# Altium project MiroCard.PrjPcb (part 1 of 2)
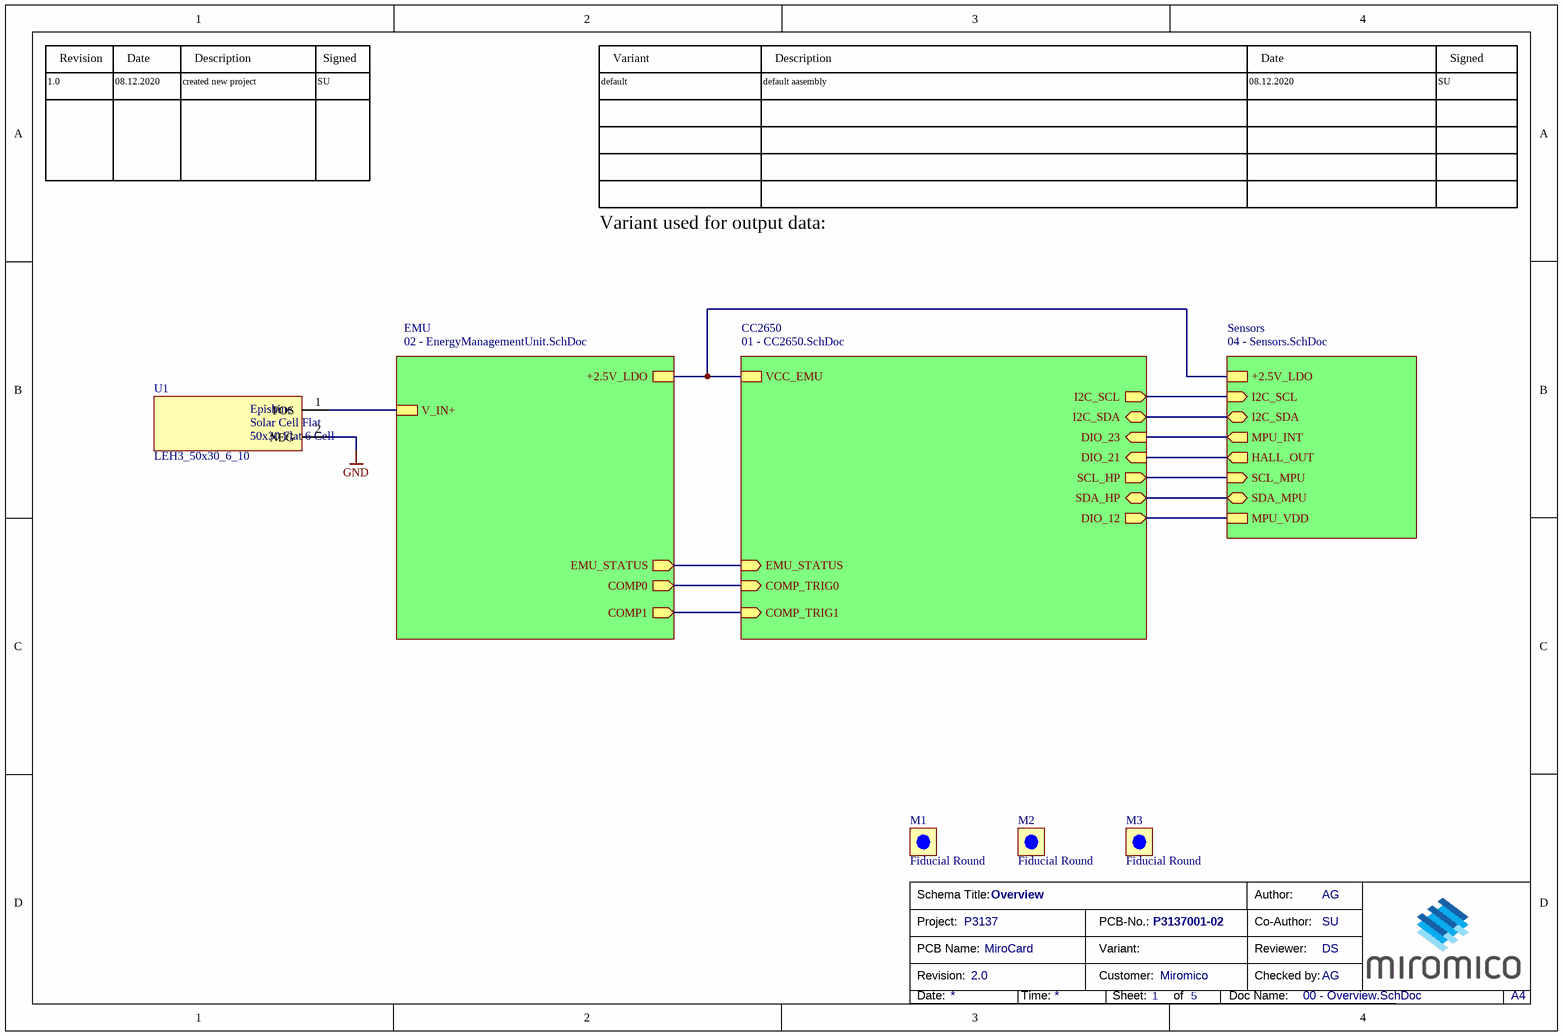
[diagram p0: 00 - Overview.SchDoc]
AuthorMiromico: AG; CheckedByMiromico: AG; CoAuthorMiromico: SU; Customer: Miromico; DrawnBy: AG; PCBName: MiroCard; PCBNumberMiromico: P3137001-02; ProjectName: MiroCard; ProjectNumberMiromico: P3137; ProjectRevision: 2.0; Reviewer: DS
5 sheets, 115 parts. Net scope: hierarchical (ports join the sheet entries above them; power ports are global).
Board files: MiroCard.PcbDoc, MiroCard_Panel.PcbDoc
Sheets:
  00 - Overview.SchDoc
    CC2650 = 01 - CC2650.SchDoc
    EMU = 02 - EnergyManagementUnit.SchDoc
      U_AEM10941 = 03 - AEM10941.SchDoc
    Sensors = 04 - Sensors.SchDoc

## Sheet 00 - Overview.SchDoc
size A4; Date: 13/4/18; Author: LS, OB, AG; DrawnBy: LS, OB, AB, AG, IM; Organization: Miromico, ETHZ; Revision: 3; SheetNumber: 1; SheetTotal: 5; SchemaTitle: Overview; ProjectName: Transient BLE System

### Parts
M1  Fiducial Round  [Fiducial round_small]  (no BOM)
M2  Fiducial Round  [Fiducial round_small]  (no BOM)
M3  Fiducial Round  [Fiducial round_small]  (no BOM)
U1  LEH3_50x30_6_10  [50x30 Flat 6 Cell - Gen 2-Footprint-1]

### Sub-sheets
CC2650 = 01 - CC2650.SchDoc: I2C_SCL (out), I2C_SDA (bidir), EMU_STATUS (in), COMP_TRIG0 (in), VCC_EMU, DIO_23 (in), DIO_21 (in), SCL_HP (out), SDA_HP (bidir), DIO_12 (out), COMP_TRIG1 (in)
EMU = 02 - EnergyManagementUnit.SchDoc: V_IN+, EMU_STATUS (out), COMP0 (out), +2.5V_LDO, COMP1 (out)
Sensors = 04 - Sensors.SchDoc: I2C_SCL (in), I2C_SDA (bidir), MPU_INT (out), +2.5V_LDO, HALL_OUT (out), SCL_MPU (in), SDA_MPU (bidir), MPU_VDD

### Nets
+2.5V_LDO: sheet CC2650/VCC_EMU, sheet EMU/+2.5V_LDO, sheet Sensors/+2.5V_LDO
GND: U1.2(NEG)
MPU_VDD: sheet CC2650/DIO_12, sheet Sensors/MPU_VDD
VSRC: U1.1(POS) ; sheet EMU/V_IN+
COMP0: sheet CC2650/COMP_TRIG0, sheet EMU/COMP0
COMP1: sheet CC2650/COMP_TRIG1, sheet EMU/COMP1
SCL: sheet CC2650/I2C_SCL, sheet Sensors/I2C_SCL
SDA: sheet CC2650/I2C_SDA, sheet Sensors/I2C_SDA
NetR402_2: sheet CC2650/SCL_HP, sheet Sensors/SCL_MPU
NetR403_2: sheet CC2650/SDA_HP, sheet Sensors/SDA_MPU
NetR404_2: sheet CC2650/DIO_23, sheet Sensors/MPU_INT
NetU100_31: sheet CC2650/DIO_21, sheet Sensors/HALL_OUT
NetU100_37: sheet CC2650/EMU_STATUS, sheet EMU/EMU_STATUS

### Notes on the sheet
- 1.0
- Revision
- 08.12.2020
- Date
- created new project
- Description
- SU
- Signed
- default
- Variant
- default aasembly
- Variant used for output data:
- Schema Title:
- Project:
- PCB-No.:
- Author:
- Co-Author:
- Revision:
- PCB Name:
- Customer:
- Variant:
- Reviewer:
- Checked by:
- Date:
- Time:
- Sheet:
- of
- Doc Name:
- A4
- (in symbol CMP-00499-06) Solar Cell Flat; 50x30 Flat 6 Cell

### Library data of the parts
M1-M3 = Fiducial Round-10: Fiducial (Optical Marker)
U1 = CMP-00499-06: Solar Cell 50x30 Flat 6 Cell; Manufacturer: Epishine; ComponentLink1Description: Datasheet; Manufacturer Part Number: LEH3_50x30_6_10; Supplier 1: Epishine; Supplier Part Number 1: LEH3_50x30_6_10

## Sheet 01 - CC2650.SchDoc: CC2650 MCU and BLE Radio
size A3; DrawnBy: LS, OB, AB, AG, IM; Organization: Miromico, ETHZ; Revision: 3; SheetNumber: 2; SheetTotal: 4; SchemaTitle: CC2650 MCU and BLE Radio
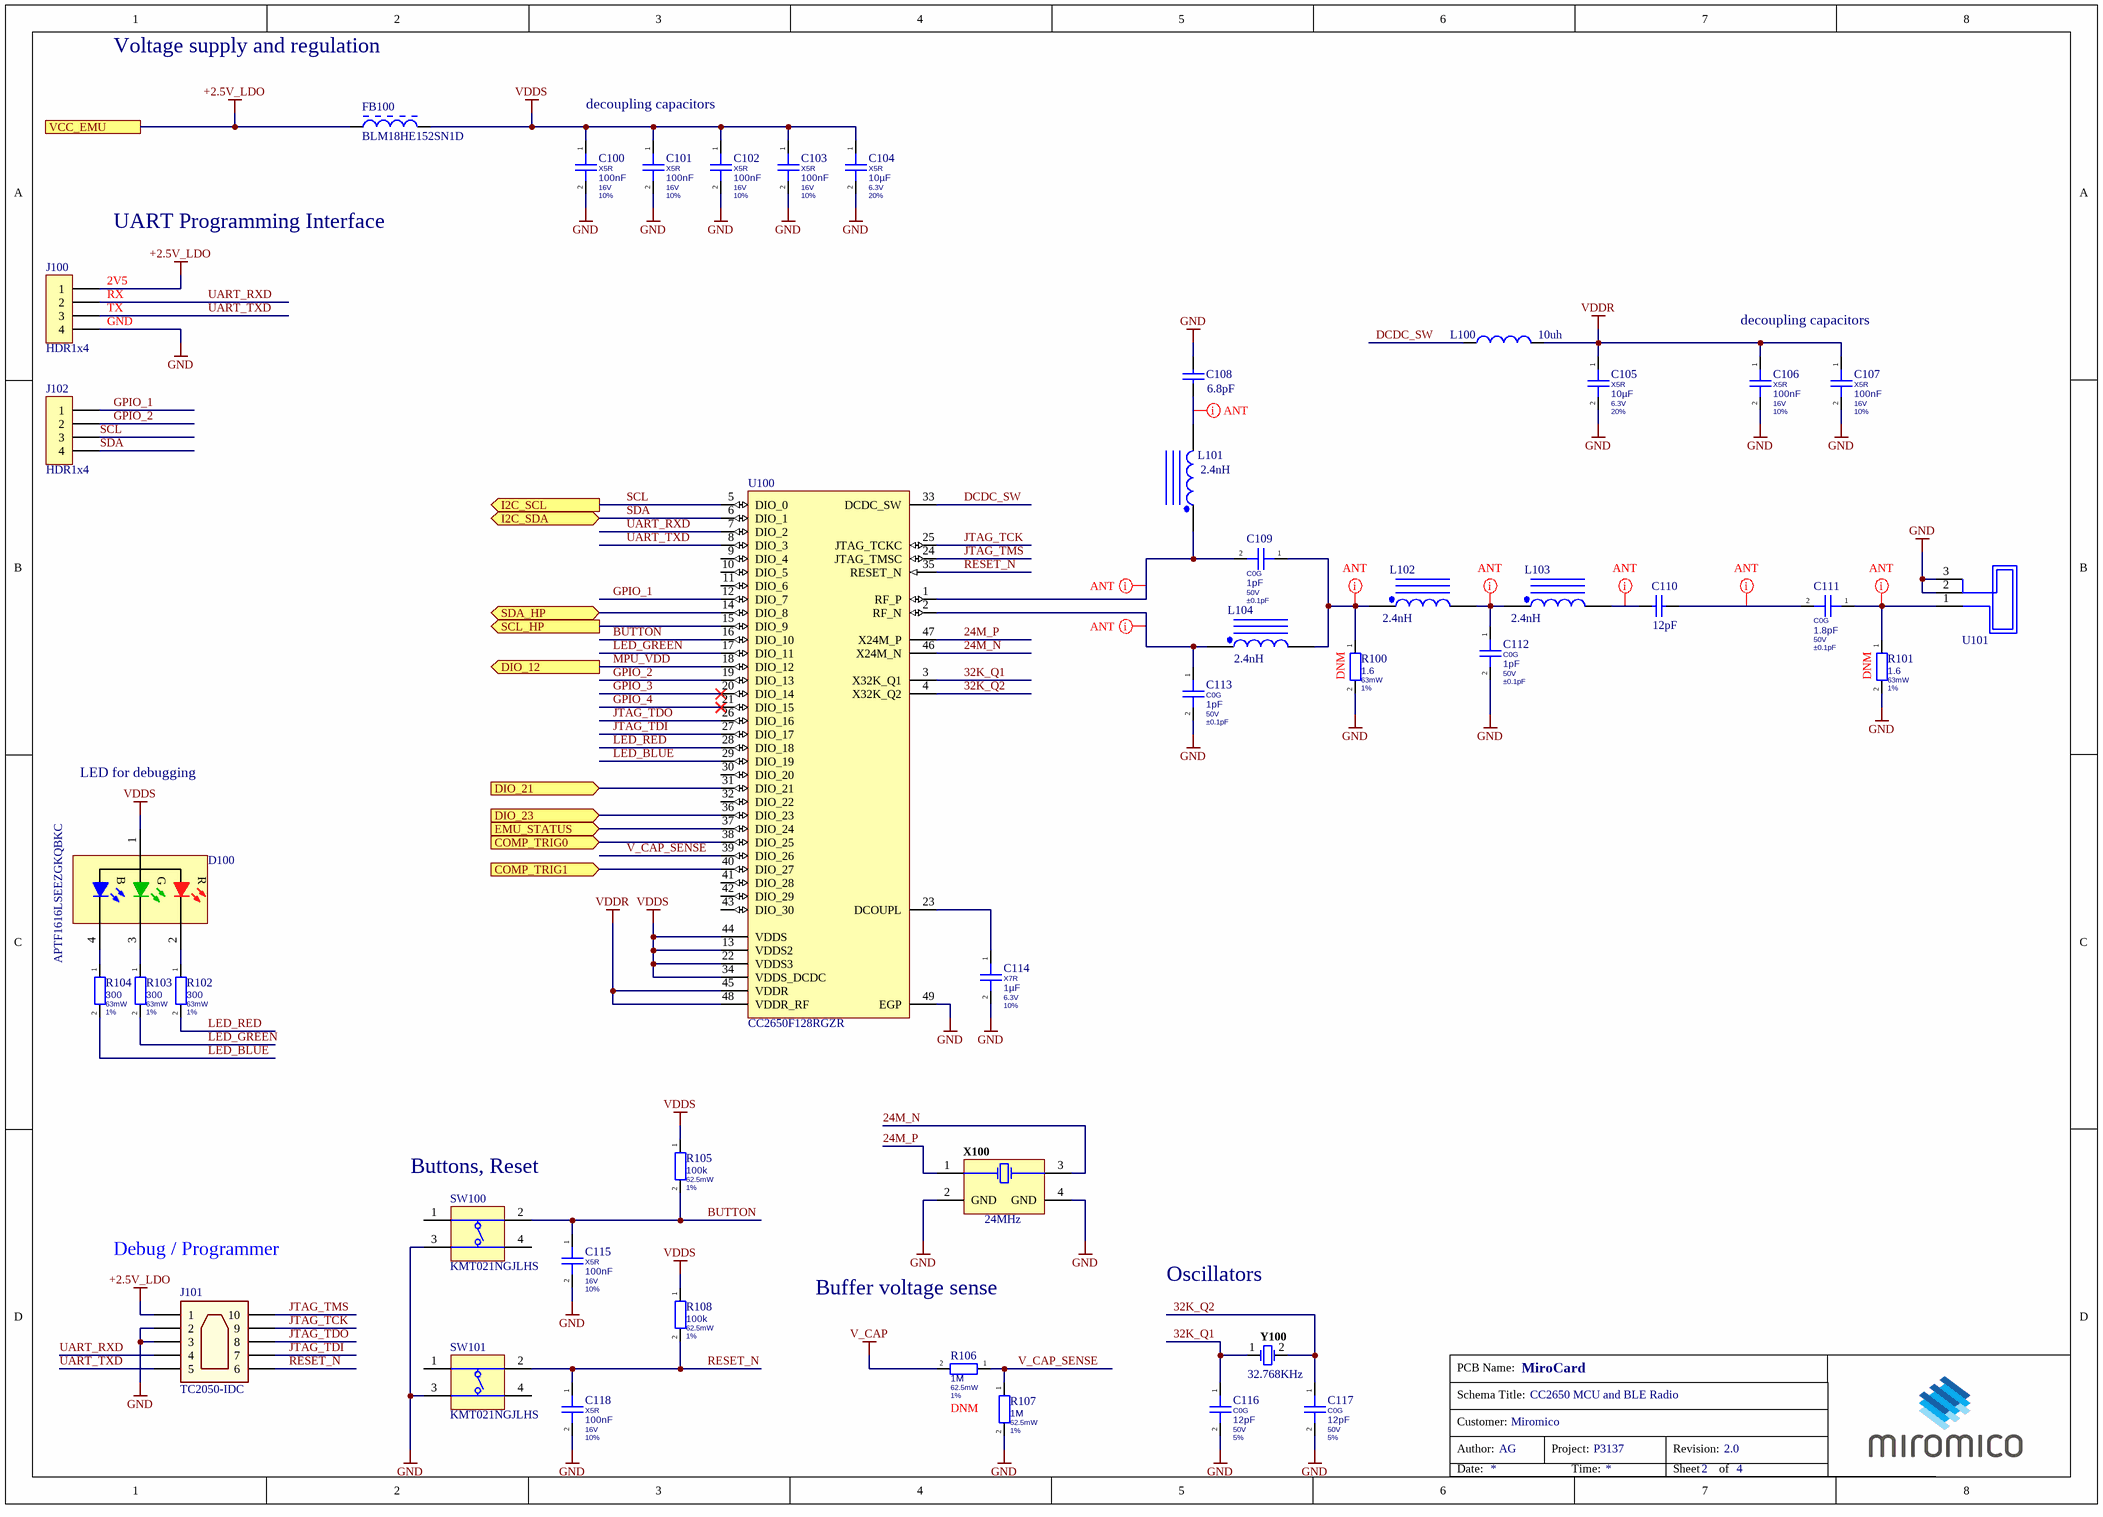
[diagram p1: 01 - CC2650.SchDoc]

### Parts
C100  Dielectric: X5R  Capacitance: 100nF  Voltage Rating: 16V  Tolerance: 10%  [CAPC0402(1005)60_L]  (hidden comment: GRM155R61C104KA88D)
C101  Dielectric: X5R  Capacitance: 100nF  Voltage Rating: 16V  Tolerance: 10%  [CAPC0402(1005)60_L]  (hidden comment: GRM155R61C104KA88D)
C102  Dielectric: X5R  Capacitance: 100nF  Voltage Rating: 16V  Tolerance: 10%  [CAPC0402(1005)60_L]  (hidden comment: GRM155R61C104KA88D)
C103  Dielectric: X5R  Capacitance: 100nF  Voltage Rating: 16V  Tolerance: 10%  [CAPC0402(1005)60_L]  (hidden comment: GRM155R61C104KA88D)
C104  Dielectric: X5R  Capacitance: 10µF  Voltage Rating: 6.3V  Tolerance: 20%  [CAPC0402(1005)60_L]  (hidden comment: GRJ155R60J106ME11D)
C105  Dielectric: X5R  Capacitance: 10µF  Voltage Rating: 6.3V  Tolerance: 20%  [CAPC0402(1005)60_L]  (hidden comment: GRJ155R60J106ME11D)
C106  Dielectric: X5R  Capacitance: 100nF  Voltage Rating: 16V  Tolerance: 10%  [CAPC0402(1005)60_L]  (hidden comment: GRM155R61C104KA88D)
C107  Dielectric: X5R  Capacitance: 100nF  Voltage Rating: 16V  Tolerance: 10%  [CAPC0402(1005)60_L]  (hidden comment: GRM155R61C104KA88D)
C108  value 6.8pF  [CAPC0402(1005)60_L]  (hidden comment: CAP 6.8pF 10V 0402(1005))
C109  Dielectric: C0G  Capacitance: 1pF  Voltage Rating: 50V  Tolerance: ±0.1pF  [CAPC0402(1005)60_L]  (hidden comment: GRM1555C1H1R0BA01D)
C110  value 12pF  [CAPC0402(1005)60_L]  (hidden comment: CAP 12pF 10V 0402(1005))
C111  Dielectric: C0G  Capacitance: 1.8pF  Voltage Rating: 50V  Tolerance: ±0.1pF  [CAPC0402(1005)60_L]  (hidden comment: GRM1555C1H1R8BA01D)
C112  Dielectric: C0G  Capacitance: 1pF  Voltage Rating: 50V  Tolerance: ±0.1pF  [CAPC0402(1005)60_L]  (hidden comment: GRM1555C1H1R0BA01D)
C113  Dielectric: C0G  Capacitance: 1pF  Voltage Rating: 50V  Tolerance: ±0.1pF  [CAPC0402(1005)60_L]  (hidden comment: GRM1555C1H1R0BA01D)
C114  Dielectric: X7R  Capacitance: 1µF  Voltage Rating: 6.3V  Tolerance: 10%  [CAPC0402(1005)60_L]  (hidden comment: GRM155R70J105KA12J)
C115  Dielectric: X5R  Capacitance: 100nF  Voltage Rating: 16V  Tolerance: 10%  [CAPC0402(1005)60_L]  (hidden comment: GRM155R61C104KA88D)
C116  Dielectric: C0G  Capacitance: 12pF  Voltage Rating: 50V  Tolerance: 5%  [CAPC0402(1005)60_L]  (hidden comment: GRM1555C1H120JA01D)
C117  Dielectric: C0G  Capacitance: 12pF  Voltage Rating: 50V  Tolerance: 5%  [CAPC0402(1005)60_L]  (hidden comment: GRM1555C1H120JA01D)
C118  Dielectric: X5R  Capacitance: 100nF  Voltage Rating: 16V  Tolerance: 10%  [CAPC0402(1005)60_L]  (hidden comment: GRM155R61C104KA88D)
D100  APTF1616LSEEZGKQBKC  [APTF1616LSEEZGKQBKC]
FB100  BLM18HE152SN1D  [MURA-BLM18-RF-H4-CHIP-2_V]
J100  HDR1x4  [HDR1x4]  (no BOM)
J101  TC2050-IDC  [TC2050-IDC-NL-10]  (no BOM)
J102  HDR1x4  [HDR1x4]  (no BOM)
L100  Inductance: 10uh  [INDC0805(2012)X11_L]  (hidden comment: CKS2125100M-T)
L101  Inductance: 2.4nH  [INDC1005X55X25LL05T10_A]  (hidden comment: LQG15HS2N4S02D)
L102  Inductance: 2.4nH  [INDC1005X55X25LL05T10_A]  (hidden comment: LQG15HS2N4S02D)
L103  Inductance: 2.4nH  [INDC1005X55X25LL05T10_A]  (hidden comment: LQG15HS2N4S02D)
L104  Inductance: 2.4nH  [INDC1005X55X25LL05T10_A]  (hidden comment: LQG15HS2N4S02D)
R100  Resistance: 1.6  Power Rating: 63mW  Tolerance: 1%  [RESC0402(1005)_L]  (hidden comment: CRCW04021R60FKED)
R101  Resistance: 1.6  Power Rating: 63mW  Tolerance: 1%  [RESC0402(1005)_L]  (hidden comment: CRCW04021R60FKED)
R102  Resistance: 300  Power Rating: 63mW  Tolerance: 1%  [RESC0402(1005)_L]  (hidden comment: RMCF0402FT300R)
R103  Resistance: 300  Power Rating: 63mW  Tolerance: 1%  [RESC0402(1005)_L]  (hidden comment: RMCF0402FT300R)
R104  Resistance: 300  Power Rating: 63mW  Tolerance: 1%  [RESC0402(1005)_L]  (hidden comment: RMCF0402FT300R)
R105  Resistance: 100k  Power Rating: 62.5mW  Tolerance: 1%  [RESC0402(1005)_L]  (hidden comment: RMCF0402FT100K)
R106  Resistance: 1M  Power Rating: 62.5mW  Tolerance: 1%  [RESC0402(1005)_L]  (hidden comment: RMCF0402FT1M00)
R107  Resistance: 1M  Power Rating: 62.5mW  Tolerance: 1%  [RESC0402(1005)_L]  (hidden comment: RMCF0402FT1M00)
R108  Resistance: 100k  Power Rating: 62.5mW  Tolerance: 1%  [RESC0402(1005)_L]  (hidden comment: RMCF0402FT100K)
SW100  KMT021NGJLHS  [KMT021NGJLHS-Footprint-1]
SW101  KMT021NGJLHS  [KMT021NGJLHS-Footprint-1]
U100  CC2650F128RGZR  [RGZ0048A_V]
U101  Antenna Patch  [2.4GHz Inverted F Antenna]  (value not drawn)  (net tie, no BOM)
X100  Frequency: 24MHz  [EPSON-TSX-3225_V]  (hidden comment: TSX-3225 24.0000MF15X-AC3)
Y100  Frequency: 32.768KHz  [ABRA-ABS07_A_V]  (hidden comment: ABS07-120-32.768KHZ-T)

### Ports
COMP_TRIG0 (in), COMP_TRIG1 (in), DIO_12 (out), DIO_21 (in), DIO_23 (in), EMU_STATUS (in), I2C_SCL (out), I2C_SDA (bidir), SCL_HP (out), SDA_HP (bidir), VCC_EMU

### Nets
+2.5V_LDO: FB100.1 J100.1 J101.1 ; port VCC_EMU
GND: C100.2 C101.2 C102.2 C103.2 C104.2 C105.2 C106.2 C107.2 C108.2 C112.2 C113.2 C114.2 C115.2 C116.2 C117.2 C118.2 J100.4 J101.2 J101.3 R100.2 R101.2 R107.2 SW100.3(T3) SW101.3(T3) U100.49(EGP) U101.2 U101.3 X100.2(GND) X100.4(GND)
MPU_VDD: U100.18(DIO_12) ; port DIO_12
V_CAP: R106.2
VDDR: C105.1 C106.1 C107.1 L100.2 U100.45(VDDR) U100.48(VDDR_RF)
VDDS: C100.1 C101.1 C102.1 C103.1 C104.1 D100.1 FB100.2 R105.1 R108.1 U100.13(VDDS2) U100.22(VDDS3) U100.34(VDDS_DCDC) U100.44(VDDS)
24M_N: U100.46(X24M_N) X100.3(X2)
24M_P: U100.47(X24M_P) X100.1(X1)
32K_Q1: C116.1 U100.3(X32K_Q1) Y100.1
32K_Q2: C117.1 U100.4(X32K_Q2) Y100.2
BUTTON: C115.1 R105.2 SW100.2(T2) U100.16(DIO_10)
COMP0: U100.38(DIO_25) ; port COMP_TRIG0
COMP1: U100.40(DIO_27) ; port COMP_TRIG1
DCDC_SW: L100.1 U100.33(DCDC_SW)
GPIO_1: J102.1 U100.12(DIO_7)
GPIO_2: J102.2 U100.19(DIO_13)
GPIO_3: U100.20(DIO_14)
GPIO_4: U100.21(DIO_15)
JTAG_TCK: J101.9 U100.25(JTAG_TCKC)
JTAG_TDI: J101.7 U100.27(DIO_17)
JTAG_TDO: J101.8 U100.26(DIO_16)
JTAG_TMS: J101.10 U100.24(JTAG_TMSC)
LED_BLUE: R104.2 U100.29(DIO_19)
LED_GREEN: R103.2 U100.17(DIO_11)
LED_RED: R102.2 U100.28(DIO_18)
RESET_N: C118.1 J101.6 R108.2 SW101.2(T2) U100.35(RESET_N)
SCL: J102.3 U100.5(DIO_0) ; port I2C_SCL
SDA: J102.4 U100.6(DIO_1) ; port I2C_SDA
UART_RXD: J100.2 J101.4 U100.7(DIO_2)
UART_TXD: J100.3 J101.5 U100.8(DIO_3)
V_CAP_SENSE: R106.1 R107.1 U100.39(DIO_26)
NetC108_1: C108.1 L101.2
NetC109_1: C109.1 L102.1 L104.2 R100.1
NetC109_2: C109.2 L101.1 U100.1(RF_P)
NetC110_1: C110.1 L103.2
NetC110_2: C110.2 C111.2
NetC111_1: C111.1 R101.1 U101.1
NetC112_1: C112.1 L102.2 L103.1
NetC113_1: C113.1 L104.1 U100.2(RF_N)
NetC114_1: C114.1 U100.23(DCOUPL)
NetD100_2: D100.2(R) R102.1
NetD100_3: D100.3(G) R103.1
NetD100_4: D100.4(B) R104.1
NetR402_2: U100.15(DIO_9) ; port SCL_HP
NetR403_2: U100.14(DIO_8) ; port SDA_HP
NetR404_2: U100.36(DIO_23) ; port DIO_23
NetU100_31: U100.31(DIO_21) ; port DIO_21
NetU100_37: U100.37(DIO_24) ; port EMU_STATUS

Not connected (* = marked no-connect by the designer): SW100 1(T1) 4(T3); SW101 1(T1) 4(T3); U100 9(DIO_4) 10(DIO_5) 11(DIO_6) 30(DIO_20) 32(DIO_22) 41(DIO_28) 42(DIO_29) 43(DIO_30)

### Layout directives
net class ANT: NetC108_1, NetC109_1, NetC109_2, NetC110_1, NetC110_2, NetC111_1, NetC112_1, NetC113_1

### Notes on the sheet
- Voltage supply and regulation
- decoupling capacitors
- UART Programming Interface
- (near J100) 2V5
- (near J100) RX
- (near J100) TX
- (near J100) GND
- (near R100) DNM
- (near R101) DNM
- LED for debugging
- (near SW100) Buttons, Reset
- Debug / Programmer
- Buffer voltage sense
- Oscillators
- DNM
- Schema Title:
- PCB Name:
- Author:
- Customer:
- Project:
- Revision:
- Date:
- Time:
- Sheet
- of

### Library data of the parts
C100-C103 C106 C107 C115 C118 = CMP-00416-01: 0.1µF ±10% 16V Ceramic Capacitor X5R 0402 (1005 Metric); Manufacturer: Murata Electronics; ComponentLink1Description: Datasheet; Manufacturer Part Number: GRM155R61C104KA88D; Supplier 1: Digi-Key; Supplier Part Number 1: 490-5415-1-ND; Mount: Surface Mount; Case/Package: 0402; Case Code (Metric): 1005; Case Code (Imperial): 0402; Min Operating Temperature: -55°C; Max Operating Temperature: 85°C; Package Quantity: 1; Packaging: Tape and Reel; Termination: SMD/SMT; Voltage: 16V; Voltage Rating (DC): 16V; Length: 1mm; Width: 0.02inch; Height: 0.5mm; Thickness: 0.022inch; Depth: 0.5mm; Radiation Hardening: No; REACH SVHC: No SVHC; Lead Free: Lead Free
C104 C105 = CMP-00462-01: 10µF ±20% 6.3V Ceramic Capacitor X5R 0402 (1005 Metric); Manufacturer: Murata Electronics; ComponentLink1Description: Datasheet; Manufacturer Part Number: GRJ155R60J106ME11D; Supplier 1: Digi-Key; Supplier Part Number 1: 490-13211-1-ND; Mount: Surface Mount; Case/Package: 0402; Case Code (Metric): 1005; Case Code (Imperial): 0402; Min Operating Temperature: -55°C; Max Operating Temperature: 85°C; Packaging: Cut Tape; Features: Soft Termination; Length: 0.039inch; Width: 0.02inch; Thickness: 0.028inch
C108 = CMP-1034-00503-1: CAP 6.8pF 10V ±5% 0402 (1005 Metric) Thickness 0.6mm SMD; Case-EIA: 0402; Case-Metric: 1005; Tolerance: Â±5%; Technology: SMT; Rated Voltage: 10 V; Max Thickness: 0.6 mm
C109 C112 C113 = CMP-00426-01: 1pF ±0.1pF 50V Ceramic Capacitor C0G, NP0 0402 (1005 Metric); Manufacturer: Murata Electronics; Temperature Coefficient: 30ppm/°C; ComponentLink1Description: Datasheet; Manufacturer Part Number: GRM1555C1H1R0BA01D; Supplier 1: Digi-Key; Supplier Part Number 1: 490-6206-1-ND; Mount: Surface Mount; Case/Package: 0402; Case Code (Metric): 1005; Case Code (Imperial): 0402; Material: Ceramic; Min Operating Temperature: -55°C; Max Operating Temperature: 125°C; Packaging: Tape and Reel; Package Quantity: 10000; Voltage Rating (DC): 50V; Termination: SMD/SMT; Voltage: 50V; Length: 1mm; Width: 0.5mm; Height: 0.5mm; Thickness: 0.022inch; Depth: 0.5mm; Radiation Hardening: No; REACH SVHC: No SVHC; Lead Free: Lead Free
C110 = CMP-1034-00750-1: CAP 12pF 10V ±2% 0402 (1005 Metric) Thickness 0.6mm SMD; Tolerance: Â±2%; Case-EIA: 0402; Case-Metric: 1005; Max Thickness: 0.6 mm; Rated Voltage: 10 V; Technology: SMT
C111 = CMP-00424-01: 1.8pF ±0.1pF 50V Ceramic Capacitor C0G, NP0 0402 (1005 Metric); Manufacturer: Murata Electronics; Temperature Coefficient: 30ppm/°C; Supplier 1: Digi-Key; Supplier Part Number 1: 490-6215-1-ND; Mount: Surface Mount; Case/Package: 0402; Case Code (Metric): 1005; Case Code (Imperial): 0402; Material: Ceramic; Min Operating Temperature: -55°C; Max Operating Temperature: 125°C; Packaging: Tape and Reel; Package Quantity: 10000; Termination: SMD/SMT; Voltage: 50V; Voltage Rating (DC): 50V; Length: 1mm; Width: 0.02inch; Height: 0.5mm; Thickness: 0.022inch; Depth: 0.5mm; Radiation Hardening: No; REACH SVHC: Unknown; Lead Free: Lead Free; ComponentLink1Description: Datasheet; Manufacturer Part Number: GRM1555C1H1R8BA01D
C114 = CMP-00441-03: 1µF ±10% 6.3V Ceramic Capacitor X7R 0402 (1005 Metric); Manufacturer: Murata Electronics; ComponentLink1Description: Datasheet; Manufacturer Part Number: GRM155R70J105KA12J; Supplier 1: Digi-Key; Supplier Part Number 1: 490-13339-1-ND; Mount: Surface Mount; Case/Package: 0402; Case Code (Metric): 1005; Case Code (Imperial): 0402; Weight: 0.000212oz; Min Operating Temperature: -55°C; Max Operating Temperature: 125°C; Packaging: Tape and Reel; Termination: SMD/SMT; Voltage Rating (DC): 6.3V; Package Quantity: 50000; Length: 0.039inch; Width: 0.02inch; Thickness: 0.022inch
C116 C117 = CMP-00428-01: 12pF ±5% 50V Ceramic Capacitor C0G, NP0 0402 (1005 Metric); Manufacturer: Murata Electronics; Temperature Coefficient: 30ppm/°C; ComponentLink1Description: Datasheet; Manufacturer Part Number: GRM1555C1H120JA01D; Supplier 1: Digi-Key; Supplier Part Number 1: 490-5924-1-ND; Mount: Surface Mount; Case/Package: 0402; Number of Pins: 2; Case Code (Imperial): 0402; Case Code (Metric): 1005; Material: Ceramic; Min Operating Temperature: -55°C; Max Operating Temperature: 125°C; Packaging: Tape and Reel; Voltage Rating (DC): 50V; Package Quantity: 10000; Termination: SMD/SMT; Voltage: 50V; Length: 1mm; Width: 0.5mm; Height: 0.5mm; Thickness: 0.022inch; Depth: 0.5mm; Radiation Hardening: No; REACH SVHC: No SVHC; Lead Free: Lead Free
D100 = CMP-00017-A.6: HELI Colour; 1.6X1.6MM LOW CURRENT RGB SMD LED; Manufacturer: Kingbright; Colour: Blue,Green,Red; Lens Colour: Colorless; Lens Transparency: Clear; Luminous Intensity: 14mcd; Test Current: 2mA; Viewing Angle: 120°; Dominant Wavelength: 465nm; Forward Voltage: 2.7V; Properties: Red, Green, Blue (RGB) 621nm Red, 525nm Green, 465nm Blue LED Indication - Discrete 1.8V Red, 2.7V Green, 2.7V Blue 0606 (1616 Metric); Case Code (Metric): 1616; Case Code (Imperial): 0606; Packaging: Tape and Reel; Case/Package: 0606; Length: 1.6mm; Height: 0.9mm; Width: 1.6mm; Manufacturer Part Number: APTF1616LSEEZGKQBKC; Supplier 1: Digi-Key; Supplier Part Number 1: 754-1972-1-ND; ComponentLink1Description: 3447e5e9f92dce591761be9cb3680f3b.pdf; ComponentLink1URL: http://www.alliedelec.com/m/d/3447e5e9f92dce591761be9cb3680f3b.pdf; Category: LED
FB100 = CMP-0686-00368-2: Chip Ferrite Bead for GHz Band High-speed Signal Lines, 1500 Ohm, 500 mA, -55 to 125 degC, 1.6 x 0.8 x 0.95 mm SMD, Tape and Reel; Manufacturer: Murata; Rated Current: 500 mA; Impedance (at 100 MHz): 1500 Ohm +/- 25%; DC Resistance: 0.50 Ohm Max.; Packing: Tape and Reel; DatasheetVersion: 08/2013; ComponentLink1URL: http://www.murata.com/; Mounting Technology: Surface Mount; ComponentLink2URL: http://www.murata.com/products/catalog/pdf/c31e.pdf; ComponentLink3Description: Package Specification; ComponentLink2Description: Datasheet; PackageReference: BLM18_H950-2; ComponentLink1Description: Manufacturer URL; PackageDescription: 2-Pin Chip, Body 1.6 x 0.8 mm; ComponentLink3URL: http://www.murata.com/products/catalog/pdf/c31e.pdf; PartNumber: BLM18HE152SN1D; Operating Temperature Range: -55 to 125 degC
J100 J102 = HDR1x4-01: 1x4 Pin Header, 2.54mm; Properties: 1x4 Pin Terminal Header, 2.54mm; SchLibComponentName: HDR1x4
J101 = TDC2050-IDC-03: TDC2050-IDC, 10Pins, dual footprint (leg and no-legs); Manufacturer: Tag-Connect; SchLibComponentName: TC2050-IDC; ComponentLink1Description: Datasheet; ComponentLink1URL: http://www.tag-connect.com/Materials/TC2050-IDC%20Datasheet.pdf; Manufacturer Part Number: TC2050-IDC
L100 = CMP-00871-1: FIXED IND 10UH 110MA 520 MOHM; Core Material: Ferrite; Tolerance: 20%; Shielding: Unshielded; Self Resonant Frequency: 24MHz; DC Resistance (DCR): 520mR; Test Frequency: 2MHz; Mount: Surface Mount; Case/Package: 0805; Case Code (Metric): 2012; Case Code (Imperial): 0805; Min Operating Temperature: -40°C; Max Operating Temperature: 85°C; Package Quantity: 2000; Current Rating: 110mA; Packaging: Tape and Reel; Inductance Tolerance: 20%; Max DC Current: 110mA; Termination: SMD/SMT; DC Current: 110mA; Military Standard: Not; Length: 2mm; Height: 1.25mm; Width: 0.049inch; Height - Seated (Max): 0.057inch; Depth: 1.45mm; Radiation Hardening: No; REACH SVHC: Unknown; Lead Free: Lead Free; Halogen Free: Halogen Free
L101-L104 = CMP-2000-06579-1: Chip Inductor, 2.4 nH, +/- 0.3 nH, 300 mA, -55 to 125 degC, 0402 (1005 Metric), RoHS, Tape and Reel; Manufacturer: MurataElectronics; Core Material: Air; Minimum Quality Factor: 8@100MHz; Tolerance: 0.3nH; Maximum DC Resistance: 150mOhm; Type: RFChip; Maximum DC Current: 300mA; Product Height: 0.55mm; Datasheet URL: http://search.murata.co.jp/Ceramy/image/img/PDF/ENG/L0075S0083LQG15HS.pdf; Mounting Technology: SurfaceMount; Package Reference: 0402; Package Description: 2-Pin Surface Mount Device, Body 1 x 0.5 mm; Category: InductorSurfaceMount; Manufacturer URL: http://www.murata.com/; Package/Case: 0402; Datasheet Version: 09/2010
R100 R101 = CMP-00467-01: 1.6 Ohms ±1% 0.063W, 1/16W Chip Resistor 0402 (1005 Metric) Automotive AEC-Q200 Thick Film; Manufacturer: Vishay Dale; Voltage Rating: 50V; Temperature Coefficient: 100ppm/°C; ComponentLink1Description: Datasheet; ComponentLink1URL: https://www.vishay.com/docs/20035/dcrcwe3.pdf; Manufacturer Part Number: CRCW04021R60FKED; Supplier 1: Digi-Key; Supplier Part Number 1: 541-1.60LLCT-ND; Case/Package: 0402; Weight: 2.3E-05oz; Case Code (Imperial): 0402; Case Code (Metric): 1005; Contact Plating: Tin; Min Operating Temperature: -55°C; Max Operating Temperature: 155°C; Packaging: Tape and Reel; Package Quantity: 10; Termination: SMD/SMT; Resistor Type: Thick Film; Number of Terminations: 2; Max Power Dissipation: 63mW; Features: Automotive AEC-Q200; Length: 0.039inch; Width: 0.5mm; Height: 0.016inch; Radiation Hardening: No; Lead Free: Lead Free
R102-R104 = CMP-00466-01: 300 Ohms ±1% 0,063W, 1/16W Chipwiderstand 0402 (1005 metrisch) AutomobilzulassungAEC-Q200 Dickschicht; Manufacturer: Stackpole Electronics Inc; Temperature Coefficient: 100ppm/°C; ComponentLink1Description: Datasheet; ComponentLink1URL: https://www.seielect.com/catalog/sei-rmcf_rmcp.pdf; Manufacturer Part Number: RMCF0402FT300R; Supplier 1: Digi-Key; Supplier Part Number 1: RMCF0402FT300RCT-ND; Mount: Surface Mount; Case/Package: 0402; Case Code (Metric): 1005; Case Code (Imperial): 0402; Contact Plating: Tin,Matte; Min Operating Temperature: -55°C; Max Operating Temperature: 155°C; Packaging: Tape and Reel; Package Quantity: 10000; Resistor Type: Thick Film; Number of Terminations: 2; Max Power Dissipation: 63mW; Features: Automotive AEC-Q200; Length: 0.039inch; Width: 0.02inch; Height: 0.016inch; Radiation Hardening: No; Lead Free: Lead Free
R105 R108 = CMP-00463-01: 100 kOhms ±1% 0,063W, 1/16W Chipwiderstand 0402 (1005 metrisch) AutomobilzulassungAEC-Q200 Dickschicht; Manufacturer: Stackpole Electronics Inc; Temperature Coefficient: 100ppm/°C; Max Power Dissipation: 63mW; ComponentLink1Description: Datasheet; ComponentLink1URL: https://www.seielect.com/catalog/sei-rmcf_rmcp.pdf; Manufacturer Part Number: RMCF0402FT100K; Supplier 1: Digi-Key; Supplier Part Number 1: RMCF0402FT100KCT-ND; Mount: Surface Mount; Case/Package: 0402; Case Code (Metric): 1005; Case Code (Imperial): 0402; Contact Plating: Tin,Matte; Min Operating Temperature: -55°C; Max Operating Temperature: 155°C; Packaging: Tape and Reel; Resistor Type: Thick Film; Number of Terminations: 2; Features: Automotive AEC-Q200; Length: 1mm; Width: 0.02inch; Height: 0.016inch; Depth: 0.5mm; Radiation Hardening: No; Military Standard: Not; Lead Free: Lead Free
R106 R107 = CMP-00464-01: 1 MOhms ±1% 0,063W, 1/16W Chipwiderstand 0402 (1005 metrisch) AutomobilzulassungAEC-Q200 Dickschicht; Manufacturer: Stackpole Electronics Inc; Max Power Dissipation: 63mW; Temperature Coefficient: 100ppm/°C; Manufacturer Part Number: RMCF0402FT1M00; Supplier 1: Digi-Key; Supplier Part Number 1: RMCF0402FT1M00CT-ND; Mount: Surface Mount; Case/Package: 0402; Case Code (Metric): 1005; Case Code (Imperial): 0402; Contact Plating: Tin,Matte; Min Operating Temperature: -55°C; Max Operating Temperature: 155°C; Packaging: Tape and Reel; Resistor Type: Thick Film; Number of Terminations: 2; Features: Automotive AEC-Q200; Length: 1mm; Width: 0.02inch; Height: 0.016inch; Depth: 0.5mm; Radiation Hardening: No; Military Standard: Not; Lead Free: Lead Free; ComponentLink1Description: Datasheet; ComponentLink1URL: https://www.seielect.com/catalog/sei-rmcf_rmcp.pdf
SW100 SW101 = CMP-00503-02: Sensorschalter Ultra-LW Tact SW SMT SPNOFa 1.6N HF; Manufacturer: C&K; ComponentLink1Description: Datasheet; ComponentLink1URL: https://www.mouser.ch/datasheet/2/60/kmt0-1841444.pdf; Manufacturer Part Number: KMT021NGJLHS; Supplier 1: Mouser; Supplier Part Number 1: 611-KMT021NGJLHS
U100 = CMP-2000-06080-1: CC2650 SimpleLink(TM) Multistandard Wireless MCU, 1.8 to 3.8 V, -40 to 85 degC, 48-Pin VFQFN, Green (RoHS & no Sb/Br), Tape and Reel; Manufacturer: Texas Instruments; Minimum Operating Supply Voltage: 1.8V; Maximum Operating Supply Voltage: 3.8V; Maximum Speed: 48MHz; Lead Finish: GoldOverNickelPalladium; Screening Level: Industrial; Program Memory Size: 128KB; Max Processing Temp: 260; Operating Supply Voltage: 2.5; RAM Size: 30KB; Operating Temperature: -40to85C; Datasheet URL: http://www.ti.com/lit/ds/symlink/cc2650.pdf; Manufacturer URL: http://www.ti.com/; Datasheet Version: Rev. B, 07/2016; Category: MicrocontrollerTools; Package Description: 48-Pin Quad Flat No-lead Package, Body 7 x 7 mm, Pitch 0.5 mm; Package Reference: RGZ0048A; Mounting Technology: SurfaceMount; Mounting: SurfaceMount
U101 = CMP-00262-1: 2.4GHz Inverted F Antenna; Technology: SMT
X100 = CMP-2000-07333-1: MHz Range Crystal, 24 MHz, -40 to 85 degC, 4-Pin SMD, RoHS, Tape and Reel; Manufacturer: Epson; Brand: EpsonTiming; Frequency Stability: 10PPM; ESR: 40Ohms; Load Capacitance: 9pF; Unit Weight: 0.000564oz; Drive Level: 200uW; Datasheet Version: 12/2015; RoHS: True; Operating Temperature Range: -40Cto+85C; Length: 3.2mm; Tolerance: 10PPM; Width: 2.5mm; Mounting Technology: SurfaceMount; Package Description: 4-Pin Surface Mount Device, Body 3.2 x 2.5 mm; Manufacturer URL: https://www.eea.epson.com/; Factory Pack Quantity: 250; Package Reference: TSX-3225; Height: 0.6mm; Mounting Style: SMD/SMT; Termination Style: SMD/SMT; Datasheet URL: https://support.epson.biz/td/api/doc_check.php?dl=brief_FA-238V_en.pdf; Type: Crystal; Series: TSX-3225; Package / Case: 3.2mmx2.5mm; Product Category: Crystals; Packaging: Reel
Y100 = CMP-2000-07587-1: Tuning Fork Crystal, 32.768 KHz, +/- 20 ppm, -40 to 85 degC, 2-Pin SMD, RoHS, Tape and Reel; Manufacturer: Abracon; Case\/Package: SMD/SMT; Series Resistance: 60KOhm; Frequency Tolerance: 20ppm; Load Capacitance: 6pF; ESR (Equivalent Series Resistance): 55KOhm; Max Operating Temperature: 85degC; Width: 0.061inch; Radiation Hardening: No; Lead Free: LeadFree; RoHSCompliant: True; Depth: 1.5mm; Datasheet URL: http://www.abracon.com/Resonators/ABS07-120-32.768kHz-T.pdf; Termination: SMD/SMT; Manufacturer URL: http://www.abracon.com/; Package Quantity: 3000; Packaging: TapeandReel; Number of Pins: 2; Height: 0.035inch; Package Description: 2-Pin Surface Mount Device, Body 3.2 x 1.5 mm; Package Reference: ABS07; Mount: SurfaceMount; Tolerance: 20ppm; Mounting Technology: SurfaceMount; REACH SVHC: NoSVHC; Datasheet Version: 11/2014; Length: 3.2mm; Min Operating Temperature: -40degC

## Sheet 02 - EnergyManagementUnit.SchDoc: Energy Management Unit
size A4; DrawnBy: LS, OB, AB, AG, IM; Organization: Miromico; Revision: 3; SheetNumber: 3; SheetTotal: 5; SchemaTitle: Energy Management Unit
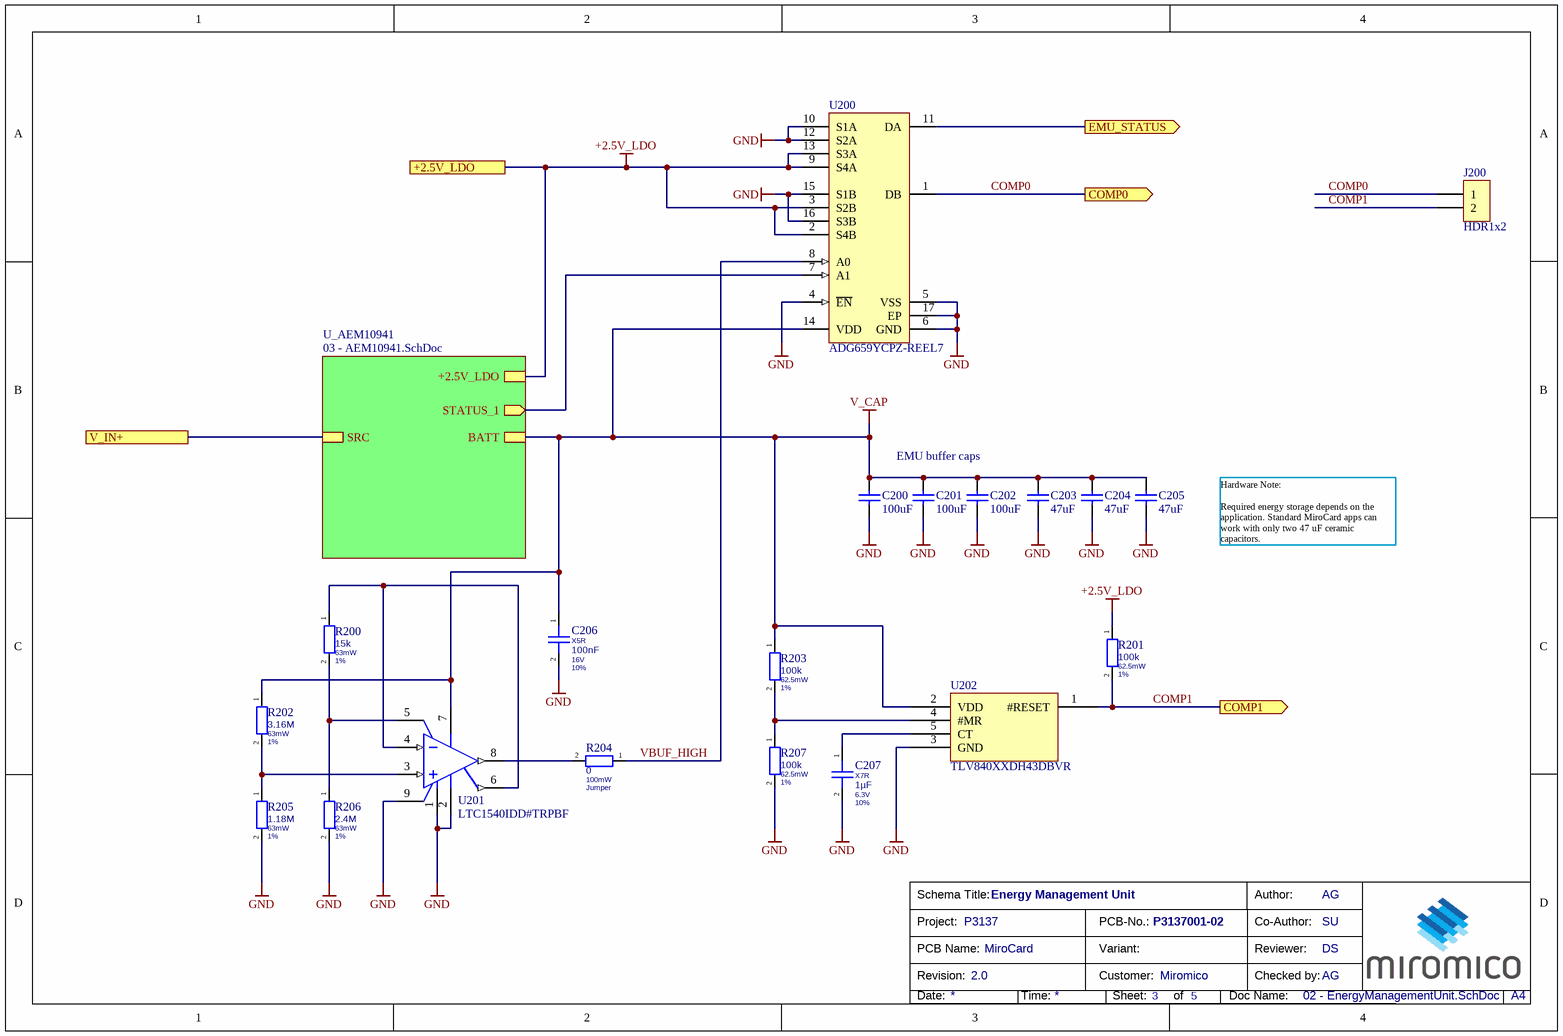
[diagram p2: 02 - EnergyManagementUnit.SchDoc]

### Parts
C200  value 100uF  [CAPC1206(3216)145_N]  (hidden comment: CAP 100uF 10V 1206(3216))
C201  value 100uF  [CAPC1206(3216)145_N]  (hidden comment: CAP 100uF 10V 1206(3216))
C202  value 100uF  [CAPC1206(3216)145_N]  (hidden comment: CAP 100uF 10V 1206(3216))
C203  value 47uF  [CAPC0805(2012)95_L]  (hidden comment: CAP 47uF 6.3V 0805(2012))
C204  value 47uF  [CAPC0805(2012)95_L]  (hidden comment: CAP 47uF 6.3V 0805(2012))
C205  value 47uF  [CAPC0805(2012)95_L]  (hidden comment: CAP 47uF 6.3V 0805(2012))
C206  Dielectric: X5R  Capacitance: 100nF  Voltage Rating: 16V  Tolerance: 10%  [CAPC0402(1005)60_L]  (hidden comment: GRM155R61C104KA88D)
C207  Dielectric: X7R  Capacitance: 1µF  Voltage Rating: 6.3V  Tolerance: 10%  [CAPC0402(1005)60_L]  (hidden comment: GRM155R70J105KA12J)
J200  HDR1x2  [HDR1x2]
R200  Resistance: 15k  Power Rating: 63mW  Tolerance: 1%  [RESC0402(1005)_L]  (hidden comment: PFR05S-153-FNH)
R201  Resistance: 100k  Power Rating: 62.5mW  Tolerance: 1%  [RESC0402(1005)_L]  (hidden comment: RMCF0402FT100K)
R202  Resistance: 3.16M  Power Rating: 63mW  Tolerance: 1%  [RESC0402(1005)_L]  (hidden comment: CRCW04023M16FKED)
R203  Resistance: 100k  Power Rating: 62.5mW  Tolerance: 1%  [RESC0402(1005)_L]  (hidden comment: RMCF0402FT100K)
R204  Resistance: 0  Power Rating: 100mW  Tolerance: Jumper  [RESC0603(1608)_L]  (hidden comment: RMCF0603ZT0R00)
R205  Resistance: 1.18M  Power Rating: 63mW  Tolerance: 1%  [RESC0402(1005)_L]  (hidden comment: RMCF0402FT1M18)
R206  Resistance: 2.4M  Power Rating: 63mW  Tolerance: 1%  [RESC0402(1005)_L]  (hidden comment: RMCF0402FT2M40)
R207  Resistance: 100k  Power Rating: 62.5mW  Tolerance: 1%  [RESC0402(1005)_L]  (hidden comment: RMCF0402FT100K)
U200  ADG659YCPZ-REEL7  [CP-16-4_L]
U201  LTC1540IDD#TRPBF  [LT-DD8_V]
U202  TLV840XXDH43DBVR  [SOT23-5 SOT-23-5]

### Sub-sheets
U_AEM10941 = 03 - AEM10941.SchDoc: STATUS_1 (out), SRC, +2.5V_LDO, BATT

### Ports
+2.5V_LDO, COMP0 (out), COMP1 (out), EMU_STATUS (out), V_IN+

### Nets
+2.5V_LDO: R201.1 U200.2(S4B) U200.3(S2B) U200.9(S4A) U200.13(S3A) ; port +2.5V_LDO, sheet U_AEM10941/+2.5V_LDO
GND: C200.1 C201.1 C202.1 C203.2 C204.2 C205.2 C206.2 C207.2 R205.2 R206.2 R207.2 U200.4(~{EN}) U200.5(VSS) U200.6(GND) U200.10(S1A) U200.12(S2A) U200.15(S1B) U200.16(S3B) U200.17(EP) U201.1(GND) U201.2(V-) U201.9(EP) U202.3(GND)
V_CAP: C200.2 C201.2 C202.2 C203.1 C204.1 C205.1 C206.1 R202.1 R203.1 U200.14(VDD) U201.7(V+) U202.2(VDD) ; sheet U_AEM10941/BATT
VSRC: port V_IN+, sheet U_AEM10941/SRC
COMP0: J200.1 U200.1(DB) ; port COMP0
COMP1: J200.2 R201.2 U202.1(#RESET) ; port COMP1
VBUF_HIGH: R204.1 U200.8(A0)
NetC207_1: C207.1 U202.5(CT)
NetR200_1: R200.1 U201.4(IN-) U201.6(REF)
NetR200_2: R200.2 R206.1 U201.5(HYST)
NetR202_2: R202.2 R205.1 U201.3(IN+)
NetR203_2: R203.2 R207.1 U202.4(#MR)
NetR204_2: R204.2 U201.8(OUT)
NetU100_37: U200.11(DA) ; port EMU_STATUS
NetU200_7: U200.7(A1) ; sheet U_AEM10941/STATUS_1

### Notes on the sheet
- EMU buffer caps
- Hardware Note:
  Required energy storage depends on the application. Standard MiroCard apps can work with only two 47 uF ceramic capacitors.
- Schema Title:
- Project:
- PCB-No.:
- Author:
- Co-Author:
- Revision:
- PCB Name:
- Customer:
- Variant:
- Reviewer:
- Checked by:
- Date:
- Time:
- Sheet:
- of
- Doc Name:
- A4

### Library data of the parts
C200-C202 = CMP-LMK316BBJ107ML-T: CAP 100uF 10V ±20% 1206 (3216 Metric) Thickness 1.45mm SMD; Tolerance: Â±20%; Case-EIA: 1206; Case-Metric: 3216; Rated Voltage: 10 V; Technology: SMT; Max Thickness: 1.45 mm
C203-C205 = CMP-GRM219R60J476ME44D : CAP 47uF 6.3V ±20% 0805 (2012 Metric) Thickness 0.95mm SMD; Tolerance: Â±20%; Case-EIA: 0805; Case-Metric: 2012; Rated Voltage: 6.3 V; Technology: SMT; Max Thickness: 0.95 mm
C206 = CMP-00416-01: as C100 on sheet 01 - CC2650; ComponentLink1Description: Datasheet; Manufacturer Part Number: GRM155R61C104KA88D; Supplier 1: Digi-Key; Supplier Part Number 1: 490-5415-1-ND; Mount: Surface Mount; Case/Package: 0402; Case Code (Metric): 1005; Case Code (Imperial): 0402; Min Operating Temperature: -55°C; Max Operating Temperature: 85°C; Package Quantity: 1; Packaging: Tape and Reel; Termination: SMD/SMT; Voltage: 16V; Voltage Rating (DC): 16V; Length: 1mm; Width: 0.02inch; Height: 0.5mm; Thickness: 0.022inch; Depth: 0.5mm; Radiation Hardening: No; REACH SVHC: No SVHC; Lead Free: Lead Free
C207 = CMP-00441-03: as C114 on sheet 01 - CC2650; ComponentLink1Description: Datasheet; Manufacturer Part Number: GRM155R70J105KA12J; Supplier 1: Digi-Key; Supplier Part Number 1: 490-13339-1-ND; Mount: Surface Mount; Case/Package: 0402; Case Code (Metric): 1005; Case Code (Imperial): 0402; Weight: 0.000212oz; Min Operating Temperature: -55°C; Max Operating Temperature: 125°C; Packaging: Tape and Reel; Termination: SMD/SMT; Voltage Rating (DC): 6.3V; Package Quantity: 50000; Length: 0.039inch; Width: 0.02inch; Thickness: 0.022inch
J200 = HDR1x2-01: 1x2 Pin Header, 2.54mm; Properties: 1x2 Pin Terminal Header, 2.54mm; SchLibComponentName: HDR1x2
R200 = CMP-00468-01: 15 kOhms ±1% 0.063W, 1/16W Chip Resistor 0402 (1005 Metric)  Thick Film; Manufacturer: Delta Electronics/Cyntec; ComponentLink1Description: Datasheet; ComponentLink1URL: http://www.cyntec.com/upfile/products/download/RH000000NH%20_A3_PFR05.pdf; Manufacturer Part Number: PFR05S-153-FNH; Supplier 1: Digi-Key; Supplier Part Number 1: 2037-PFR05S-153-FNHCT-ND
R201 R203 R207 = CMP-00463-01: as R105 on sheet 01 - CC2650; ComponentLink1Description: Datasheet; ComponentLink1URL: https://www.seielect.com/catalog/sei-rmcf_rmcp.pdf; Manufacturer Part Number: RMCF0402FT100K; Supplier 1: Digi-Key; Supplier Part Number 1: RMCF0402FT100KCT-ND; Mount: Surface Mount; Case/Package: 0402; Case Code (Metric): 1005; Case Code (Imperial): 0402; Contact Plating: Tin,Matte; Min Operating Temperature: -55°C; Max Operating Temperature: 155°C; Packaging: Tape and Reel; Resistor Type: Thick Film; Number of Terminations: 2; Features: Automotive AEC-Q200; Length: 1mm; Width: 0.02inch; Height: 0.016inch; Depth: 0.5mm; Radiation Hardening: No; Military Standard: Not; Lead Free: Lead Free
R202 = CMP-00469-01: 3.16 MOhms ±1% 0.063W, 1/16W Chip Resistor 0402 (1005 Metric) Automotive AEC-Q200 Thick Film; Manufacturer: Vishay Dale; Voltage Rating: 50V; Temperature Coefficient: 100ppm/°C; ComponentLink1Description: Datasheet; ComponentLink1URL: https://www.vishay.com/docs/20035/dcrcwe3.pdf; Manufacturer Part Number: CRCW04023M16FKED; Supplier 1: Digi-Key; Supplier Part Number 1: 541-3.16MLCT-ND; Case/Package: 0402; Number of Pins: 2; Weight: 2.3E-05oz; Case Code (Metric): 1005; Case Code (Imperial): 0402; Contact Plating: Tin; Min Operating Temperature: -55°C; Max Operating Temperature: 155°C; Package Quantity: 10000; Packaging: Tape and Reel; Resistor Type: Thick Film; Number of Terminations: 2; Termination: SMD/SMT; Max Power Dissipation: 63mW; Voltage Rating (DC): 50V; Features: Automotive AEC-Q200; Length: 1mm; Width: 0.02inch; Height: 0.016inch; Depth: 0.5mm; Radiation Hardening: No; REACH SVHC: Unknown; Military Standard: Not; Lead Free: Lead Free
R204 = CMP-00472-01: 0 Ohms Jumper 0.1W, 1/10W Chip Resistor 0603 (1608 Metric) Automotive AEC-Q200 Thick Film; Manufacturer: Stackpole Electronics Inc; Current Rating: 1A; Working Voltage: 75V; ComponentLink1Description: Datasheet; ComponentLink1URL: https://www.seielect.com/catalog/sei-rmcf_rmcp.pdf; Manufacturer Part Number: RMCF0603ZT0R00; Supplier 1: Digi-Key; Supplier Part Number 1: RMCF0603ZT0R00CT-ND; Mount: Surface Mount; Case/Package: 0603; Case Code (Metric): 1608; Case Code (Imperial): 0603; Contact Plating: Tin,Matte; Min Operating Temperature: -55°C; Max Operating Temperature: 155°C; Packaging: Tape and Reel; Resistor Type: Thick Film; Number of Terminations: 2; Max Power Dissipation: 100mW; Features: Automotive AEC-Q200; Length: 1.55mm; Width: 0.031inch; Height: 0.022inch; Depth: 0.8mm; Radiation Hardening: No; Military Standard: Not; Lead Free: Lead Free
R205 = CMP-00470-01: 1.18 MOhms ±1% 0.063W, 1/16W Chip Resistor 0402 (1005 Metric) Automotive AEC-Q200 Thick Film; Manufacturer: Stackpole Electronics Inc; Temperature Coefficient: 200ppm/°C; ComponentLink1Description: Datasheet; ComponentLink1URL: https://www.seielect.com/catalog/sei-rmcf_rmcp.pdf; Manufacturer Part Number: RMCF0402FT1M18; Supplier 1: Digi-Key; Supplier Part Number 1: RMCF0402FT1M18CT-ND; Mount: Surface Mount; Case/Package: 0402; Contact Plating: Tin,Matte; Min Operating Temperature: -55°C; Max Operating Temperature: 155°C; Packaging: Tape and Reel; Resistor Type: Thick Film; Package Quantity: 10000; Number of Terminations: 2; Max Power Dissipation: 63mW; Features: Automotive AEC-Q200; Length: 0.039inch; Width: 0.02inch; Height: 0.016inch; Radiation Hardening: No
R206 = CMP-00471-01: 2.4 MOhms ±1% 0.063W, 1/16W Chip Resistor 0402 (1005 Metric) Automotive AEC-Q200 Thick Film; Manufacturer: Stackpole Electronics Inc; Temperature Coefficient: 200ppm/°C; ComponentLink1Description: Datasheet; ComponentLink1URL: https://www.seielect.com/catalog/sei-rmcf_rmcp.pdf; Manufacturer Part Number: RMCF0402FT2M40; Supplier 1: Digi-Key; Supplier Part Number 1: RMCF0402FT2M40CT-ND; Mount: Surface Mount; Case/Package: 0402; Contact Plating: Tin,Matte; Min Operating Temperature: -55°C; Max Operating Temperature: 155°C; Packaging: Tape and Reel; Resistor Type: Thick Film; Package Quantity: 10000; Number of Terminations: 2; Max Power Dissipation: 63mW; Features: Automotive AEC-Q200; Length: 0.039inch; Width: 0.02inch; Height: 0.016inch; Radiation Hardening: No
U200 = CMP-0798-00243-1: 3 V / 5 V / +/-5 V CMOS 4-Channel Analog Multiplexer, -40 to 85 degC, 16-pin QFN (CP-16-4), Reel; Manufacturer: Analog Devices; Ron (ohms): 45; Max Analog Signal Range: Vss to Vdd; t transition (s): 80n; Bandwidth (Hz): 400M; Supply V Guar Performance: Dual_(+/-5V), Single_(+3.3V), Single_(+3V), Single_(+5V); DatasheetVersion: Rev. B; PackageVersion: 010606-0, 01/2006; PackageReference: CP-16-4; Packing: Reel; Mounting Technology: Surface Mount; ComponentLink3URL: http://www.analog.com/static/imported-files/packages/46009454504174339653421710019CP_16_4.pdf; ComponentLink2Description: Datasheet; ComponentLink3Description: Package Specification; Code_JEDEC: MO-220-VGGC; PackageDescription: 16-Pin Lead Frame Chip Scale Package, Body 4 x 4 mm, Pitch 0.65 mm; ComponentLink1Description: Manufacturer URL; ComponentLink2URL: http://www.analog.com/static/imported-files/data_sheets/ADG658_659.pdf; ComponentLink1URL: http://www.analog.com/en/index.html; PartNumber: ADG659YCPZ-REEL7
U201 = CMP-0360-00091-2: Nanopower Comparator with Reference, 1 Channel, 2 to 11 V, -40 to +85 degC, 8-pin Plastic DFN (DD8), Tape and Reel; Manufacturer: Linear Technology; Channels (#): 1; Vos (mV) Guaranteed: 12; Vs Min (V): 2; Prop Delay (us): 50; Supply Current (uA) Typical: 0.3; Supply Voltage Range: 2 to 11 V; Vs Max (V): 11; Supply Current (uA) Guaranteed: 0.68; ComponentLink2URL: http://cds.linear.com/docs/en/datasheet/1540fas.pdf; PackageDescription: 8-Pin Plastic DFN, Body 3 Ã— 3 mm, Pitch 0.5 mm; ComponentLink1URL: http://www.linear.com/; Vos (mV) Typical: 12; Generic Part Number: LTC1540; ComponentLink3Description: Package Specification; Features: Reference, Comparator; ComponentLink3URL: http://cds.linear.com/docs/en/packaging/DFN_8_05-08-1698.pdf; PartNumber: LTC1540IDD#TRPBF; DatasheetVersion: Rev A; RoHS: Y; Mounting Technology: Surface Mount; Code_JEDEC: M0-229; ComponentLink2Description: Datasheet; PackageReference: DD8; ComponentLink1Description: Manufacturer URL
U202 = CMP-00473-01: Low-voltage supervisor with adjustable-reset time delay and manual reset; Manufacturer: Texas Instruments; ComponentLink1Description: Datasheet; ComponentLink1URL: https://www.ti.com/lit/ds/symlink/tlv840.pdf?ts=1604051563341&ref_url=https%253A%252F%252Fwww.ti.com%252Fproduct%252FTLV840; Manufacturer Part Number: TLV840XXDH43DBVR; Supplier 1: Texas Instruments; Supplier Part Number 1: TLV840XXDH43DBVR

## Sheet 03 - AEM10941.SchDoc: Boost Converter
size A4; DrawnBy: LS, OB, AB, AG, IM; Organization: Miromico, ETHZ; Revision: 3; SheetNumber: 4; SheetTotal: 5; SchemaTitle: Harvester
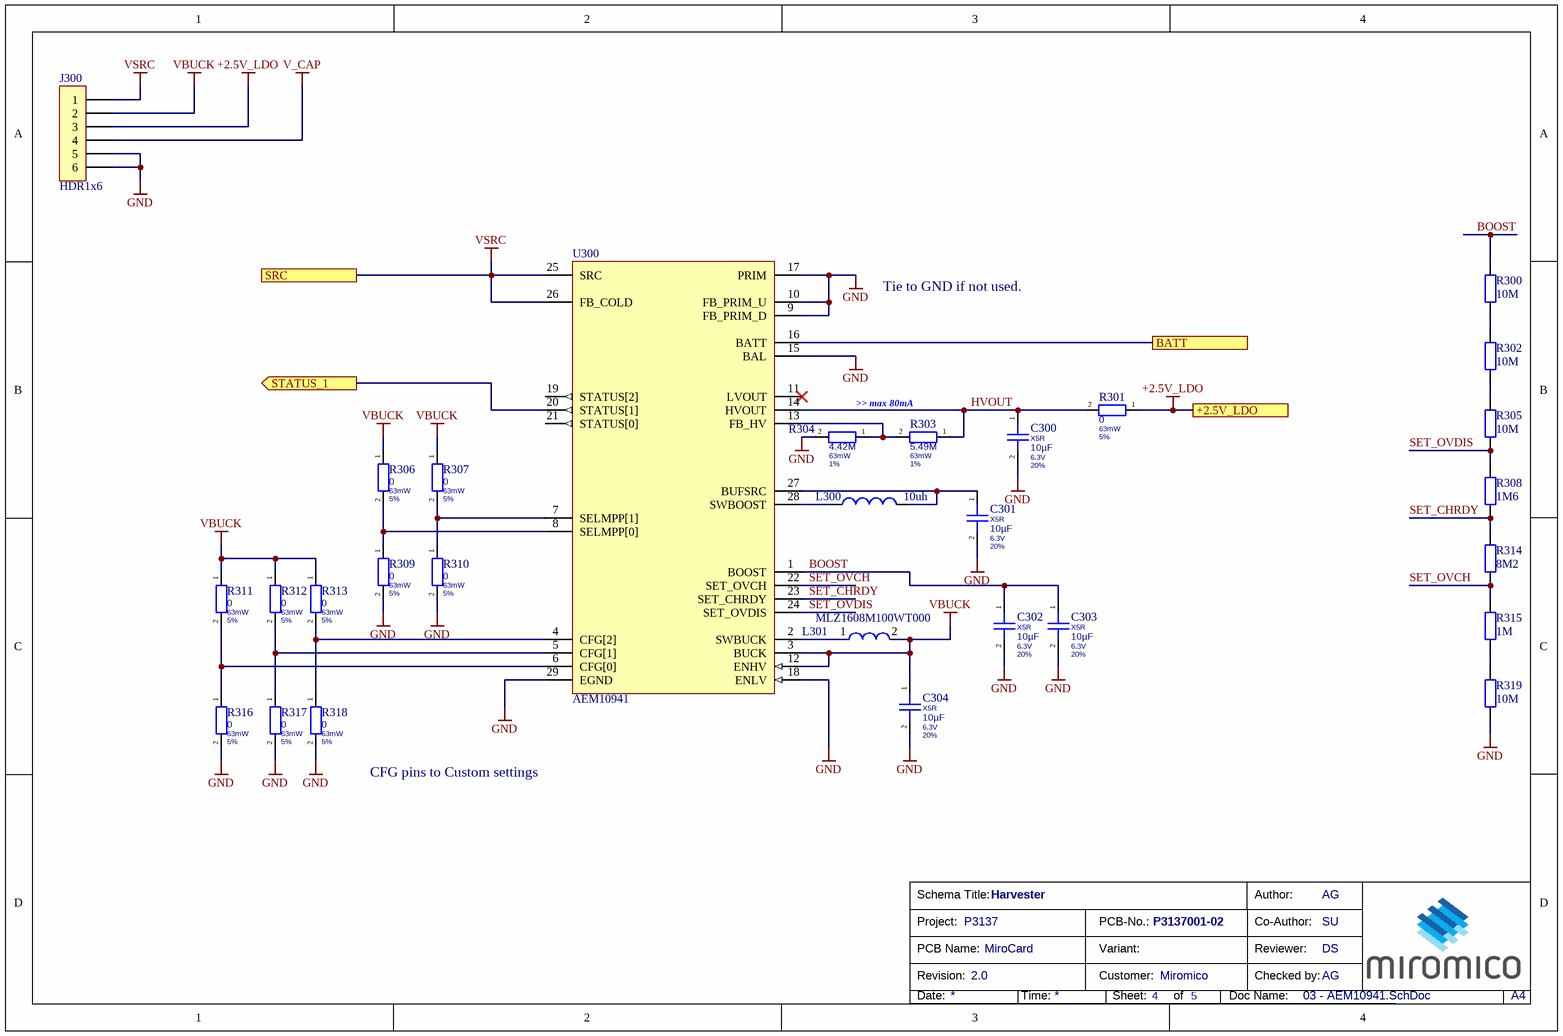
[diagram p3: 03 - AEM10941.SchDoc]

### Parts
C300  Dielectric: X5R  Capacitance: 10µF  Voltage Rating: 6.3V  Tolerance: 20%  [CAPC0402(1005)60_L]  (hidden comment: GRJ155R60J106ME11D)
C301  Dielectric: X5R  Capacitance: 10µF  Voltage Rating: 6.3V  Tolerance: 20%  [CAPC0402(1005)60_L]  (hidden comment: GRJ155R60J106ME11D)
C302  Dielectric: X5R  Capacitance: 10µF  Voltage Rating: 6.3V  Tolerance: 20%  [CAPC0402(1005)60_L]  (hidden comment: GRJ155R60J106ME11D)
C303  Dielectric: X5R  Capacitance: 10µF  Voltage Rating: 6.3V  Tolerance: 20%  [CAPC0402(1005)60_L]  (hidden comment: GRJ155R60J106ME11D)
C304  Dielectric: X5R  Capacitance: 10µF  Voltage Rating: 6.3V  Tolerance: 20%  [CAPC0402(1005)60_L]  (hidden comment: GRJ155R60J106ME11D)
J300  HDR1x6  [HDR1x6]
L300  Inductance: 10uh  [INDC0805(2012)X11_L]  (hidden comment: CKS2125100M-T)
L301  MLZ1608M100WT000  [FP-MLZ1608-MFG]
R300  10M  [RESC0402(1005)_L]
R301  Resistance: 0  Power Rating: 63mW  Tolerance: 5%  [RESC0402(1005)_L]  (hidden comment: RMCF0402ZT0R00)
R302  10M  [RESC0402(1005)_L]
R303  Resistance: 5.49M  Power Rating: 63mW  Tolerance: 1%  [RESC0402(1005)_L]  (hidden comment: CRCW04025M49FKED)
R304  Resistance: 4.42M  Power Rating: 63mW  Tolerance: 1%  [RESC0402(1005)_L]  (hidden comment: CRCW04024M42FKED)
R305  10M  [RESC0402(1005)_L]
R306  Resistance: 0  Power Rating: 63mW  Tolerance: 5%  [RESC0402(1005)_L]  (hidden comment: RMCF0402ZT0R00)
R307  Resistance: 0  Power Rating: 63mW  Tolerance: 5%  [RESC0402(1005)_L]  (hidden comment: RMCF0402ZT0R00)
R308  1M6  [RESC0402(1005)_L]
R309  Resistance: 0  Power Rating: 63mW  Tolerance: 5%  [RESC0402(1005)_L]  (hidden comment: RMCF0402ZT0R00)
R310  Resistance: 0  Power Rating: 63mW  Tolerance: 5%  [RESC0402(1005)_L]  (hidden comment: RMCF0402ZT0R00)
R311  Resistance: 0  Power Rating: 63mW  Tolerance: 5%  [RESC0402(1005)_L]  (hidden comment: RMCF0402ZT0R00)
R312  Resistance: 0  Power Rating: 63mW  Tolerance: 5%  [RESC0402(1005)_L]  (hidden comment: RMCF0402ZT0R00)
R313  Resistance: 0  Power Rating: 63mW  Tolerance: 5%  [RESC0402(1005)_L]  (hidden comment: RMCF0402ZT0R00)
R314  8M2  [RESC0402(1005)_L]
R315  1M  [RESC0402(1005)_L]
R316  Resistance: 0  Power Rating: 63mW  Tolerance: 5%  [RESC0402(1005)_L]  (hidden comment: RMCF0402ZT0R00)
R317  Resistance: 0  Power Rating: 63mW  Tolerance: 5%  [RESC0402(1005)_L]  (hidden comment: RMCF0402ZT0R00)
R318  Resistance: 0  Power Rating: 63mW  Tolerance: 5%  [RESC0402(1005)_L]  (hidden comment: RMCF0402ZT0R00)
R319  10M  [RESC0402(1005)_L]
U300  AEM10941  [QFN50P500X500X85_HS-29N]

### Ports
+2.5V_LDO, BATT, SRC, STATUS_1 (out)

### Nets
+2.5V_LDO: J300.3 R301.1 ; port +2.5V_LDO
GND: C300.2 C301.2 C302.2 C303.2 C304.2 J300.5 J300.6 R304.2 R309.2 R310.2 R316.2 R317.2 R318.2 R319.2 U300.9(FB_PRIM_D) U300.10(FB_PRIM_U) U300.15(BAL) U300.17(PRIM) U300.18(ENLV) U300.29(EGND)
V_CAP: J300.4 U300.16(BATT) ; port BATT
VBUCK: C304.1 J300.2 L301.2 R306.1 R307.1 R311.1 R312.1 R313.1 U300.3(BUCK) U300.12(ENHV)
VSRC: J300.1 U300.25(SRC) U300.26(FB_COLD) ; port SRC
BOOST: C302.1 C303.1 R300.1 U300.1(BOOST)
HVOUT: C300.1 R301.2 R303.1 U300.14(HVOUT)
SET_CHRDY: R308.2 R314.1 U300.23(SET_CHRDY)
SET_OVCH: R314.2 R315.1 U300.22(SET_OVCH)
SET_OVDIS: R305.2 R308.1 U300.24(SET_OVDIS)
NetC301_1: C301.1 L300.2 U300.27(BUFSRC)
NetL300_1: L300.1 U300.28(SWBOOST)
NetL301_1: L301.1 U300.2(SWBUCK)
NetR300_2: R300.2 R302.1
NetR302_2: R302.2 R305.1
NetR303_2: R303.2 R304.1 U300.13(FB_HV)
NetR306_2: R306.2 R309.1 U300.8(SELMPP[0])
NetR307_2: R307.2 R310.1 U300.7(SELMPP[1])
NetR311_2: R311.2 R316.1 U300.6(CFG[0])
NetR312_2: R312.2 R317.1 U300.5(CFG[1])
NetR313_2: R313.2 R318.1 U300.4(CFG[2])
NetR315_2: R315.2 R319.1
NetU200_7: U300.20(STATUS[1]) ; port STATUS_1

Not connected (* = marked no-connect by the designer): U300 11(LVOUT)* 19(STATUS[2]) 21(STATUS[0])

### Notes on the sheet
- Tie to GND if not used.
- >> max 80mA
- CFG pins to Custom settings
- Schema Title:
- Project:
- PCB-No.:
- Author:
- Co-Author:
- Revision:
- PCB Name:
- Customer:
- Variant:
- Reviewer:
- Checked by:
- Date:
- Time:
- Sheet:
- of
- Doc Name:
- A4

### Library data of the parts
C300-C304 = CMP-00462-01: as C104 on sheet 01 - CC2650; ComponentLink1Description: Datasheet; Manufacturer Part Number: GRJ155R60J106ME11D; Supplier 1: Digi-Key; Supplier Part Number 1: 490-13211-1-ND; Mount: Surface Mount; Case/Package: 0402; Case Code (Metric): 1005; Case Code (Imperial): 0402; Min Operating Temperature: -55°C; Max Operating Temperature: 85°C; Packaging: Cut Tape; Features: Soft Termination; Length: 0.039inch; Width: 0.02inch; Thickness: 0.028inch
J300 = HDR1x6-01: 1x6 Pin Header, 2.54mm; Properties: 1x6 Pin Terminal Header, 2.54mm; SchLibComponentName: HDR1x6
L300 = CMP-00871-1: as L100 on sheet 01 - CC2650; Mount: Surface Mount; Case/Package: 0805; Case Code (Metric): 2012; Case Code (Imperial): 0805; Min Operating Temperature: -40°C; Max Operating Temperature: 85°C; Package Quantity: 2000; Current Rating: 110mA; Packaging: Tape and Reel; Inductance Tolerance: 20%; Max DC Current: 110mA; Termination: SMD/SMT; DC Current: 110mA; Military Standard: Not; Length: 2mm; Height: 1.25mm; Width: 0.049inch; Height - Seated (Max): 0.057inch; Depth: 1.45mm; Radiation Hardening: No; REACH SVHC: Unknown; Lead Free: Lead Free; Halogen Free: Halogen Free
L301 = CMP-08253-000012-1: FIXED IND 10UH 250MA 1.05 OHM; Manufacturer: TDK; Series Resistance: 1.05Ω; Tolerance: 20%; Shielding: true; Core Material: Ferrite; Saturation Current: 90mA; Test Frequency: 2MHz; Digikey Description: FIXED IND 10UH 250MA 1.05 OHM; Inductance: 10uH; Composition: Multilayer; Device Class L3: Fixed Inductors; Temperature: -55°C to +125°C; RoHS: TRUE; Temperature Range High: +125°C; Automotive: No; Device Class L2: Inductors; Value: 10uH; Temperature Range Low: -55°C; Rms Current: 250mA; Manufacturer Part Number: MLZ1608M100WT000; Category: Ind; Height: 0.95mm; Package: MLZ1608; Device Class L1: Passive Components; Lead Free: Yes; ComponentLink2Description: Datasheet; Octopart: https://octopart.com/mlz1608m100wt000-tdk-22244539; Ipc Land Pattern Name: CAPC16080X80; ComponentLink2URL: https://product.tdk.com/info/en/catalog/datasheets/inductor_commercial_decoupling_mlz1608_en.pdf
R300 R302 R305 R308 R314 R315 R319 = R_Chip-08: Chip Resistor; Properties: 1%; SchLibComponentName: R_Chip
R301 R306 R307 R309-R313 R316-R318 = CMP-00412-07: 0 Ohms Jumper 0.063W, 1/16W Chip Resistor 0402 (1005 Metric) Automotive AEC-Q200 Thick Film; Manufacturer: Stackpole Electronics Inc; ComponentLink1Description: Datasheet; ComponentLink1URL: https://www.seielect.com/catalog/sei-rmcf_rmcp.pdf; Manufacturer Part Number: RMCF0402ZT0R00; Supplier 1: Digi-Key; Supplier Part Number 1: RMCF0402ZT0R00CT-ND; Max Power Dissipation: 63mW
R303 = CMP-00501-01: 5.49 MOhms ±1% 0.063W, 1/16W Chip Resistor 0402 (1005 Metric) Automotive AEC-Q200 Thick Film; Manufacturer: Vishay Dale; Voltage Rating: 50V; Temperature Coefficient: 100ppm/°C; ComponentLink1Description: Datasheet; ComponentLink1URL: https://www.vishay.com/docs/20035/dcrcwe3.pdf; Manufacturer Part Number: CRCW04025M49FKED; Supplier 1: Digi-Key; Supplier Part Number 1: 541-5.49MLCT-ND; Case/Package: 0402; Number of Pins: 2; Weight: 2.3E-05oz; Case Code (Metric): 1005; Case Code (Imperial): 0402; Contact Plating: Tin; Min Operating Temperature: -55°C; Max Operating Temperature: 155°C; Packaging: Tape and Reel; Package Quantity: 10; Resistor Type: Thick Film; Number of Terminations: 2; Termination: SMD/SMT; Max Power Dissipation: 63mW; Voltage Rating (DC): 50V; Features: Automotive AEC-Q200; Length: 1mm; Width: 0.02inch; Height: 0.016inch; Depth: 0.5mm; REACH SVHC: Unknown; Military Standard: Not; Lead Free: Lead Free
R304 = CMP-00502-01: 4.42 MOhms ±1% 0.063W, 1/16W Chip Resistor 0402 (1005 Metric) Automotive AEC-Q200 Thick Film; Manufacturer: Vishay Dale; Voltage Rating: 50V; Temperature Coefficient: 100ppm/°C; ComponentLink1Description: Datasheet; ComponentLink1URL: https://www.vishay.com/docs/20035/dcrcwe3.pdf; Manufacturer Part Number: CRCW04024M42FKED; Supplier 1: Digi-Key; Supplier Part Number 1: 541-4.42MLCT-ND; Case/Package: 0402; Number of Pins: 2; Weight: 2.3E-05oz; Case Code (Imperial): 0402; Case Code (Metric): 1005; Contact Plating: Tin; Min Operating Temperature: -55°C; Max Operating Temperature: 155°C; Package Quantity: 10; Packaging: Tape and Reel; Resistor Type: Thick Film; Termination: SMD/SMT; Number of Terminations: 2; Max Power Dissipation: 63mW; Voltage Rating (DC): 50V; Features: Automotive AEC-Q200; Length: 1mm; Width: 0.5mm; Height: 0.016inch; Depth: 0.5mm; Radiation Hardening: No; REACH SVHC: Unknown; Military Standard: Not; Lead Free: Lead Free
U300 = CMP-00302-04: Highly-efficient, regulated dual-output, ambient energy manager; Manufacturer: e-peas; ComponentLink1Description: Datasheet; Manufacturer Part Number: AEM10941; Supplier 1: e-peas; Supplier Part Number 1: AEM10941